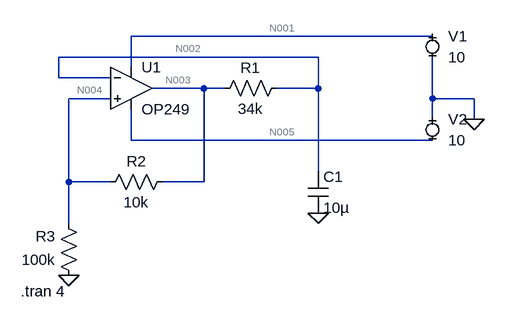
[diagram p0: schematic 4_генератор прямокутного тактового сигналу.asc]
* 4_генератор прямокутного тактового сигналу.asc
* U1: OP249 (symbol EXTRA\AudioOpamp\AD\OP249 not available, pins judged from their places): In+=N004 In-=N002 V+=N001 V-=N005 OUT=N003
V1 N001 0 10
V2 0 N005 10
R1 N002 N003 34k
C1 N002 0 10µ
R2 N003 N004 10k
R3 0 N004 100k
.tran 4
.backanno
.end

* Results of the author's LTspice run, read from the files saved beside the schematic
* Operating Point, zero values left out:
*   V(n004) = 2.016 mV
*   V(n002) = 2.216 mV
*   V(n005) = -10 V
*   V(n001) = 10 V
*   V(n003) = 2.219 mV
*   I(R3) = -20.16 nA
*   I(R2) = 20.24 nA
*   I(R1) = -68.15 pA
*   I(V2) = -2.628 mA
*   I(V1) = -2.628 mA
*   Ix(u1:1) = 74.02 pA
*   Ix(u1:2) = 68.02 pA
*   Ix(u1:99) = 2.628 mA
*   Ix(u1:50) = -2.628 mA
*   Ix(u1:30) = -20.31 nA
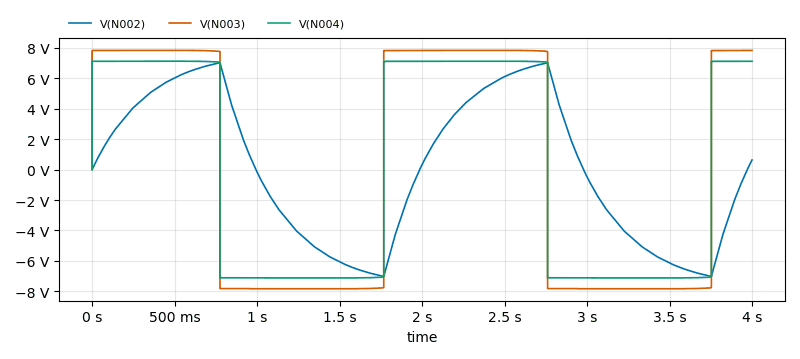
[diagram p1: Transient Analysis of 4_генератор прямокутного тактового сигналу.asc, plotted from the saved traces]
* Transient Analysis, 1 run:
*   V(N002): min -7.023 V, max 7.023 V, average 3.774 mV, rms 4.865 V, last 630.7 mV
*   V(N003): min -7.836 V, max 7.836 V, average 56.34 mV, rms 7.828 V, last 7.83 V
*   V(N004): min -7.124 V, max 7.124 V, average 51.22 mV, rms 7.117 V, last 7.119 V